# EAGLE design me433 (EAGLE 8.7.1)
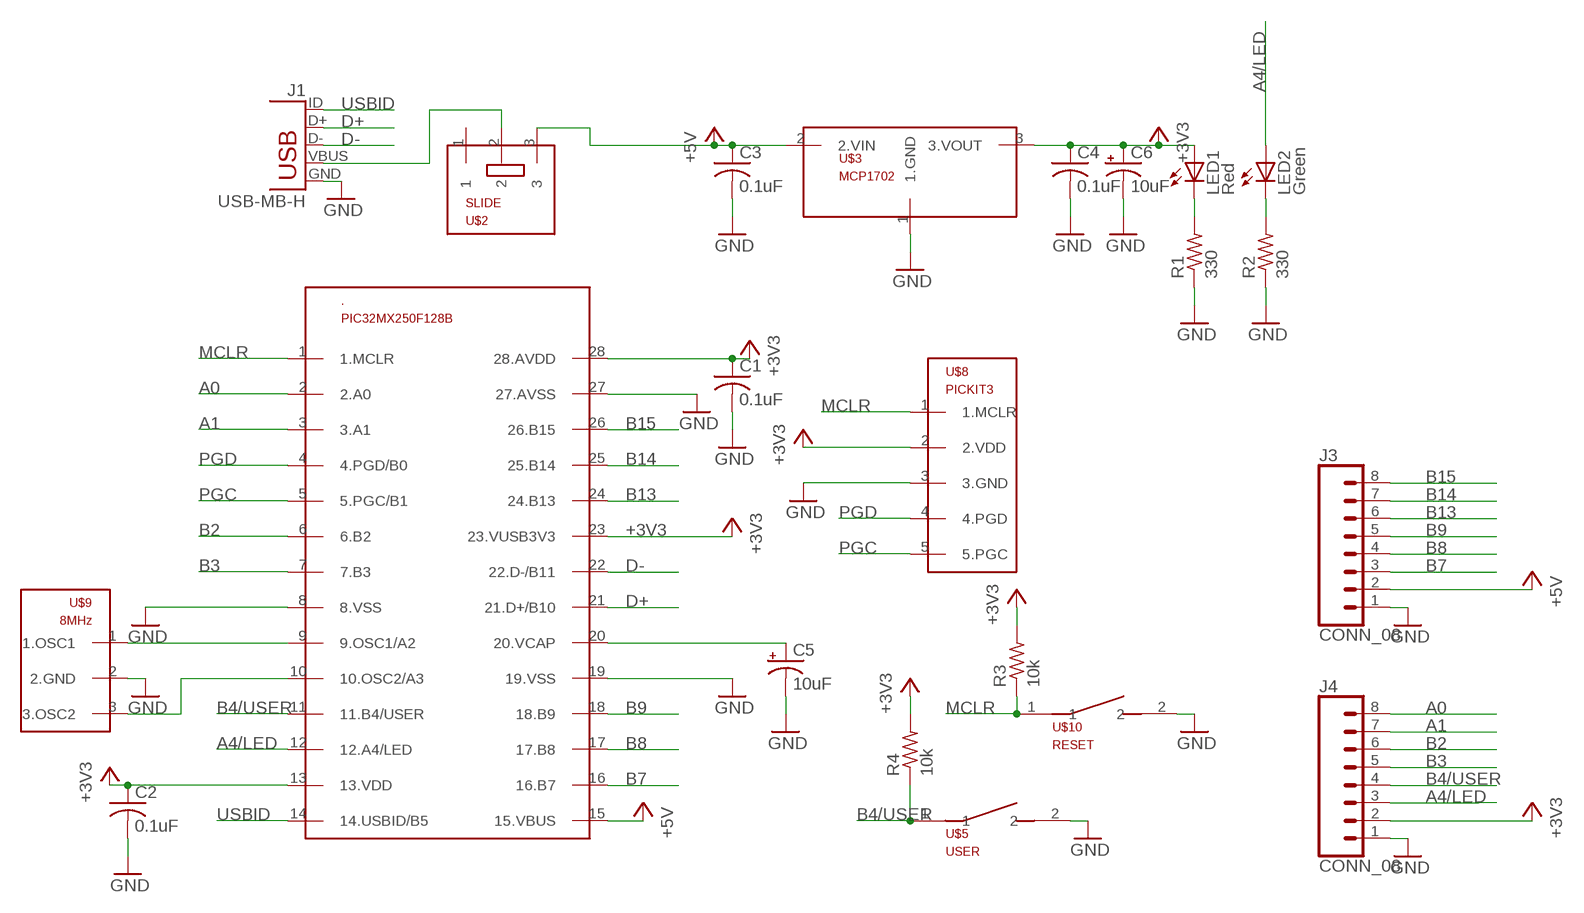
[diagram p0: schematic, sheet 1]

## Parts
.  PIC32MX250F128B  [DIL28-3]
C1  0.1uF  C-US025-025X050  [C025-025X050]
C2  0.1uF  C-US025-025X050  [C025-025X050]
C3  0.1uF  C-US025-025X050  [C025-025X050]
C4  0.1uF  C-US025-025X050  [C025-025X050]
C5  10uF  CPOL-USB45181B  [B45181B]
C6  10uF  CPOL-USB45181B  [B45181B]
J1  USB-MB-H  [USB-MB-H]
J3  CONN_08  [1X08]
J4  CONN_08  [1X08]
LED1  Red  LED3MM  [LED3MM]
LED2  Green  LED3MM  [LED3MM]
R1  330  R-US_0207/10  [0207/10]
R2  330  R-US_0207/10  [0207/10]
R3  10k  R-US_0207/10  [0207/10]
R4  10k  R-US_0207/10  [0207/10]
U$2  SLIDE  [SLIDE]
U$3  MCP1702  [TO92]
U$5  USER  PB  [PB]
U$8  PICKIT3  [1X05]
U$9  8MHz  OSC  [OSC]
U$10  RESET  PB  [PB]

## Nets
+3V3: ..13(13.VDD) ..23(23.VUSB3V3) ..28(28.AVDD) C1.1 C2.1 C4.1 C6.+ J4.2 LED1.A R3.2 R4.2 U$3.3(3.VOUT) U$8.2(2.VDD)
+5V: ..15(15.VBUS) C3.1 J3.2 U$2.3 U$3.2(2.VIN)
A0: ..2(2.A0) J4.8
A1: ..3(3.A1) J4.7
A4/LED: ..12(12.A4/LED) J4.3 LED2.A
B2: ..6(6.B2) J4.6
B3: ..7(7.B3) J4.5
B4/USER: ..11(11.B4/USER) J4.4 R4.1 U$5.1
B7: ..16(16.B7) J3.3
B8: ..17(17.B8) J3.4
B9: ..18(18.B9) J3.5
B13: ..24(24.B13) J3.6
B14: ..25(25.B14) J3.7
B15: ..26(26.B15) J3.8
D+: ..21(21.D+/B10) J1.D+
D-: ..22(22.D-/B11) J1.D-
GND: ..8(8.VSS) ..19(19.VSS) ..27(27.AVSS) C1.2 C2.2 C3.2 C4.2 C5.- C6.- J1.GND J3.1 J4.1 R1.1 R2.1 U$3.1(1.GND) U$5.2 U$8.3(3.GND) U$9.2(2.GND) U$10.2
MCLR: ..1(1.MCLR) R3.1 U$8.1(1.MCLR) U$10.1
N$1: LED2.K(C) R2.2
N$2: ..9(9.OSC1/A2) U$9.1(1.OSC1)
N$3: ..10(10.OSC2/A3) U$9.3(3.OSC2)
N$4: LED1.K(C) R1.2
N$6: ..20(20.VCAP) C5.+
PGC: ..5(5.PGC/B1) U$8.5(5.PGC)
PGD: ..4(4.PGD/B0) U$8.4(4.PGD)
USBID: ..14(14.USBID/B5) J1.ID
VBUS: J1.VBUS U$2.2
Unconnected: U$2.1

## Library data of the parts
. = me433:PIC32MX250F128B
C1-C4 = resistor:C-US: CAPACITOR, American symbol
C5 C6 = resistor:CPOL-US: POLARIZED CAPACITOR, American symbol
J1 = me433:USB: USB Connectors USB-B-PTH is fully proven SKU : PRT-00139/CONN-08278 USB-miniB is fully proven SKU : PRT-00587 USB-A-PCB is untested. USB-A-H is throughly reviewed, but untested. Spark Fun Electronics SKU : PRT-00437 USB-B-SMT is throughly reviewed, but untested. Needs silkscreen touching up. USB-A-S has not been used/tested USB-MB-H has not been used/tested USB-MICROB has been used. CONN-09505
J3 J4 = me433:CONN_08
LED1 LED2 = led:LED: LED OSRAM: - CHIPLED LG R971, LG N971, LY N971, LG Q971, LY Q971, LO R971, LY R971 LH N974, LH R974 LS Q976, LO Q976, LY Q976 LO Q996 - Hyper CHIPLED LW Q18S LB Q993, LB Q99A, LB R99A - SideLED LS A670, LO A670, LY A670, LG A670, LP A670 LB A673, LV A673, LT A673, LW A673 LH A674 LY A675 LS A676, LA A676, LO A676, LY A676, LW A676 LS A679, LY A679, LG A679 - Hyper Micro SIDELED® LS Y876, LA Y876, LO Y876, LY Y876 LT Y87S - SmartLED LW L88C, LW L88S LB L89C, LB L89S, LG L890 LS L89K, LO L89K, LY L89K LS L896, LA L896, LO L896, LY L896 - TOPLED LS T670, LO T670, LY T670, LG T670, LP T670 LSG T670, LSP T670, LSY T670, LOP T670, LYG T670 LG T671, LOG T671, LSG T671 LB T673, LV T673, LT T673, LW T673 LH T674 LS T676, LA T676, LO T676, LY T676, LB T676, LH T676, LSB T676, LW T676 LB T67C, LV T67C, LT T67C, LS T67K, LO T67K, LY T67K, LW E67C LS E67B, LA E67B, LO E67B, LY E67B, LB E67C, LV E67C, LT E67C LW T67C LS T679, LY T679, LG T679 LS T770, LO T770, LY T770, LG T770, LP T770 LB T773, LV T773, LT T773, LW T773 LH T774 LS E675, LA E675, LY E675, LS T675 LS T776, LA T776, LO T776, LY T776, LB T776 LHGB T686 LT T68C, LB T68C - Hyper Mini TOPLED® LB M676 - Mini TOPLED Santana® LG M470 LS M47K, LO M47K, LY M47K Source: http://www.osram.convergy.de LUXEON: - LUMILED® LXK2-PW12-R00, LXK2-PW12-S00, LXK2-PW14-U00, LXK2-PW14-V00 LXK2-PM12-R00, LXK2-PM12-S00, LXK2-PM14-U00 LXK2-PE12-Q00, LXK2-PE12-R00, LXK2-PE12-S00, LXK2-PE14-T00, LXK2-PE14-U00 LXK2-PB12-K00, LXK2-PB12-L00, LXK2-PB12-M00, LXK2-PB14-N00, LXK2-PB14-P00, LXK2-PB14-Q00 LXK2-PR12-L00, LXK2-PR12-M00, LXK2-PR14-Q00, LXK2-PR14-R00 LXK2-PD12-Q00, LXK2-PD12-R00, LXK2-PD12-S00 LXK2-PH12-R00, LXK2-PH12-S00 LXK2-PL12-P00, LXK2-PL12-Q00, LXK2-PL12-R00 Source: www.luxeon.com KINGBRIGHT: KA-3528ASYC Source: www.kingbright.com
R1-R4 = resistor:R-US_: RESISTOR, American symbol
U$2 = me433:SLIDE
U$3 = me433:MCP1702
U$5 U$10 = me433:PB
U$8 = me433:PICKIT3
U$9 = me433:OSC

## Board
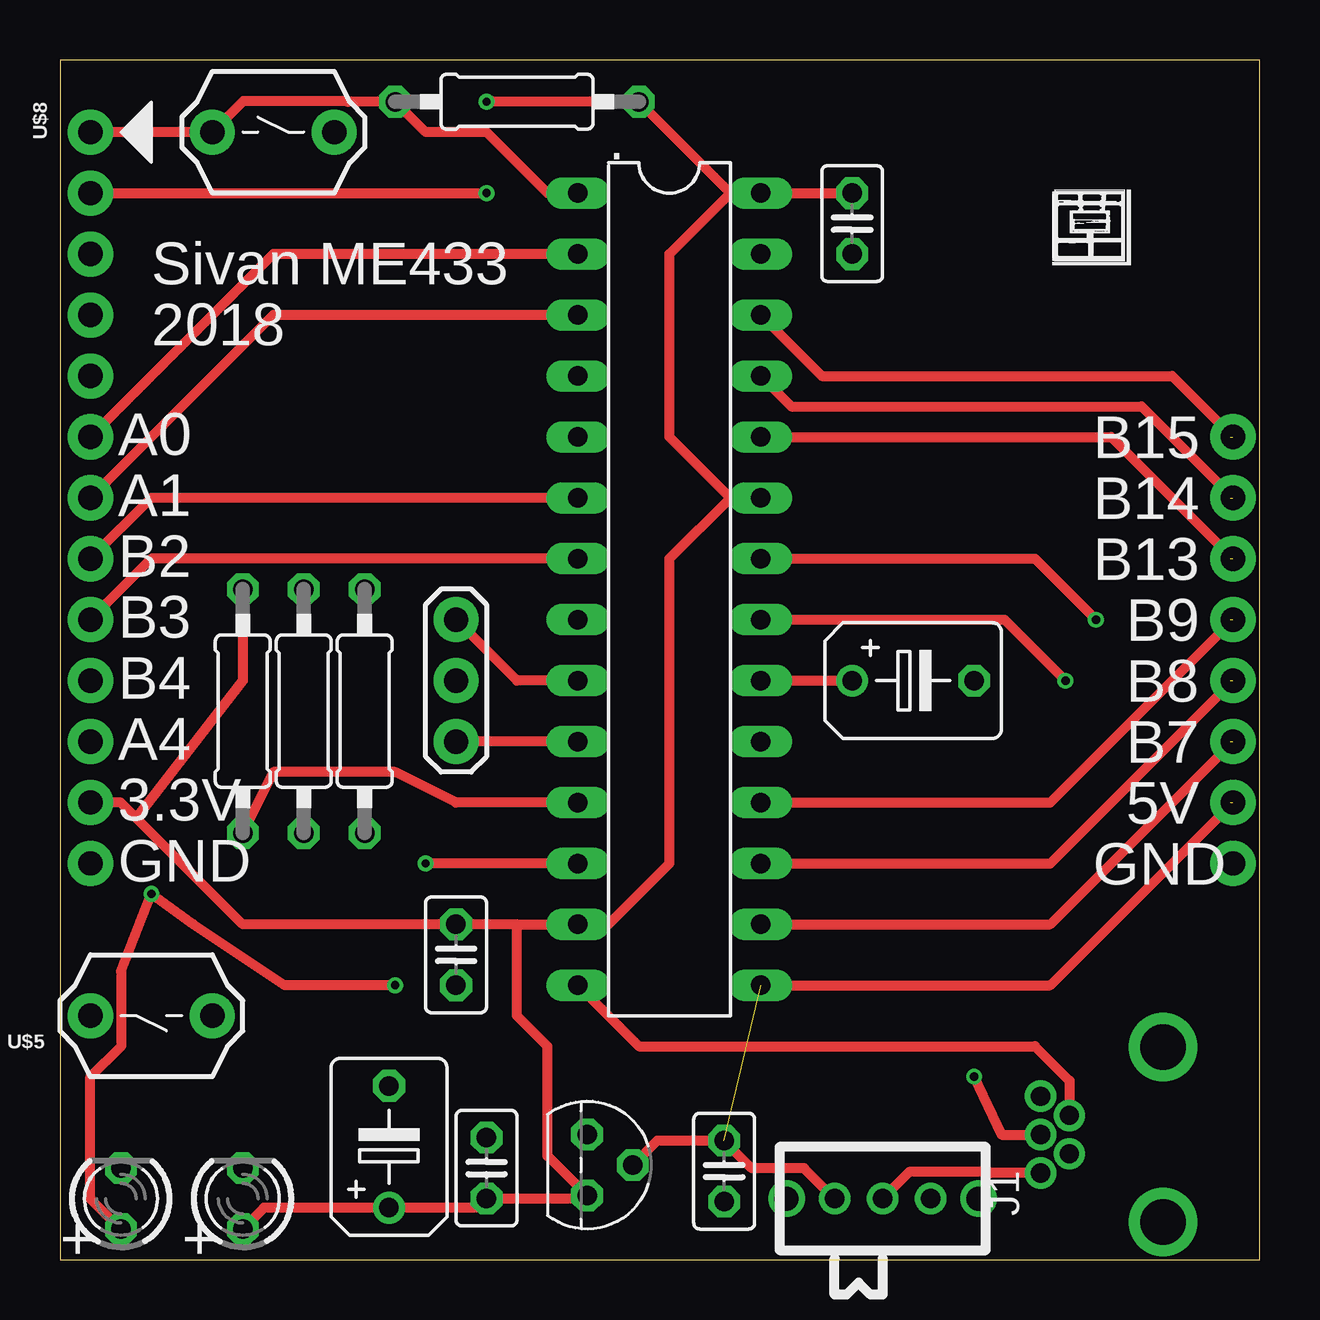
[diagram p1: board, top side]
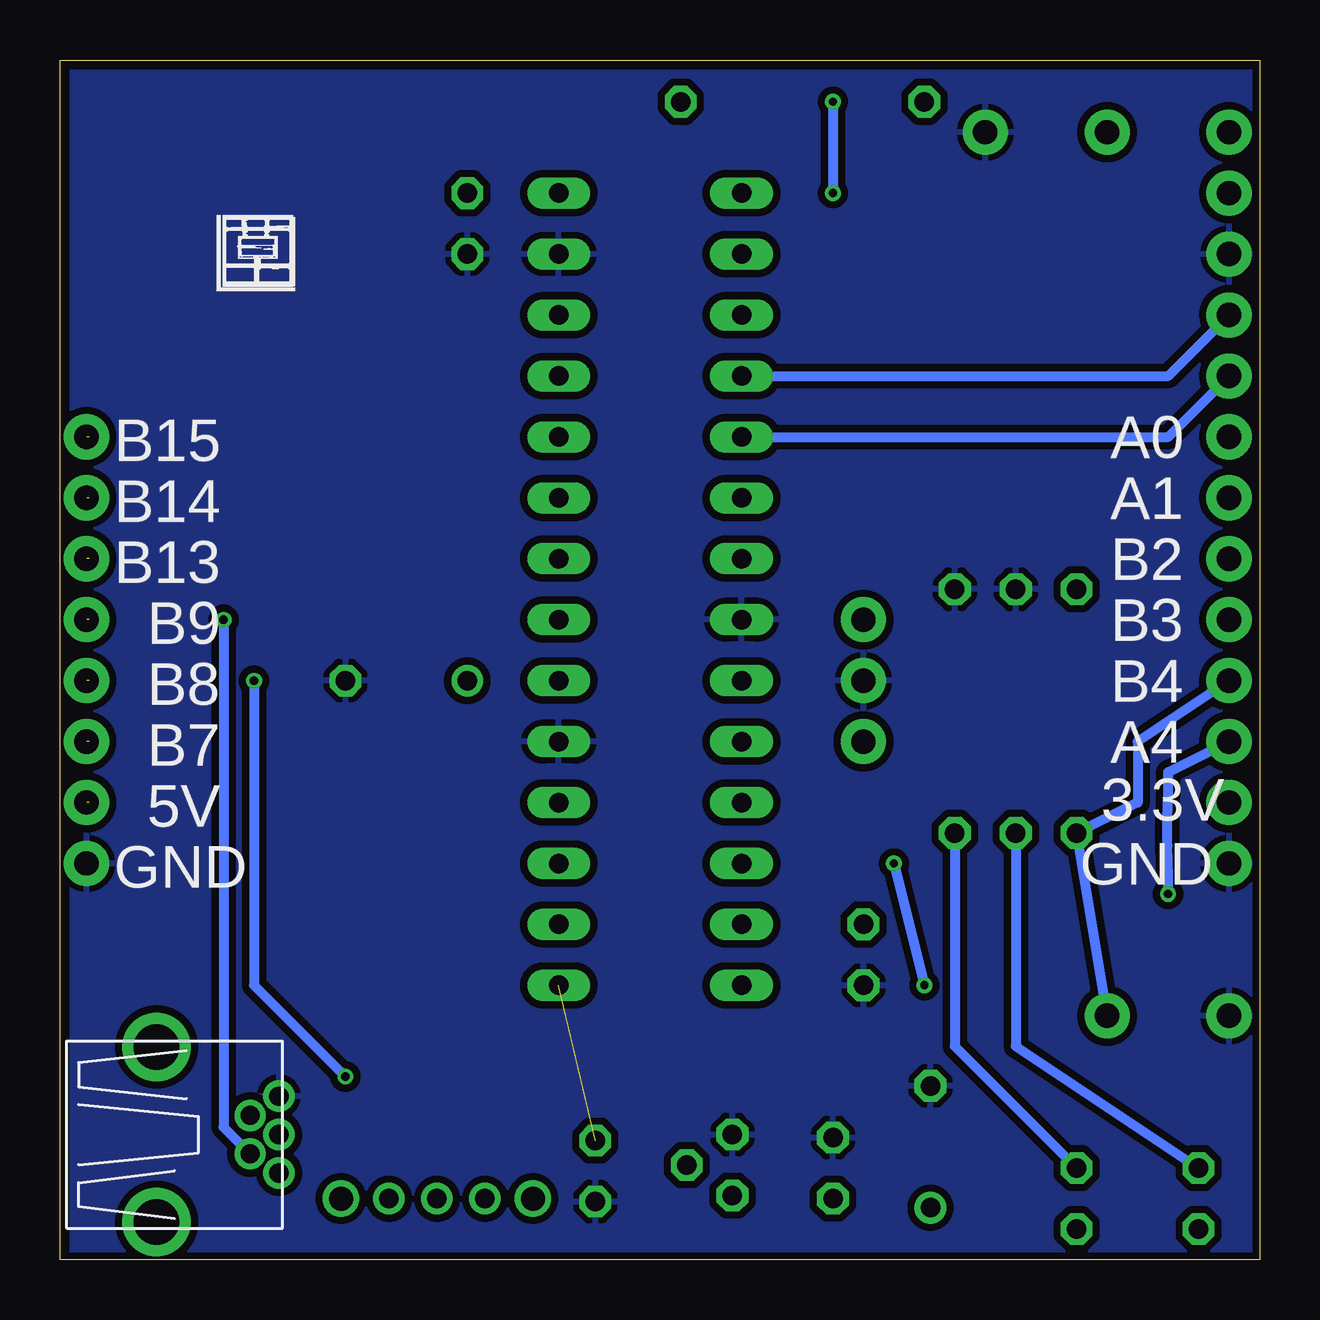
[diagram p2: board, bottom side, seen from below]

Size 50 x 50 mm. Coordinates in mm from the lower left corner, seen from the top.
Outline: 0,0 50,0 50,50 0,50 0,0
Copper layers (1*16): Top 0.035mm / dielectric 1.5mm / Bottom 0.035mm
Design rules "SeeedStudio_2layer_DRU_no_angle_20140221": minimum track width 6mil, minimum drill 12mil, track to track 6mil, track to pad 6mil, pad to pad 6mil, via to via 6mil, smd to smd 0mil, copper to edge 10mil, drill to drill 10mil, minimum pad ring 10mil, minimum via ring 6mil, stop-mask expansion 2mil, vias tented up to drill 100mil, thermal gap 10mil

### Footprints (pad centres in the part's own frame; a part is rotated, then mirrored left to right if it is on the bottom)
DIL28-3 = drill 0.813 long: 1 -16.51,-3.81; 2 -13.97,-3.81; 3 -11.43,-3.81; 4 -8.89,-3.81; 5 -6.35,-3.81; 6 -3.81,-3.81; 7 -1.27,-3.81; 8 1.27,-3.81; 9 3.81,-3.81; 10 6.35,-3.81; 11 8.89,-3.81; 12 11.43,-3.81; 13 13.97,-3.81; 14 16.51,-3.81; 15 16.51,3.81; 16 13.97,3.81; 17 11.43,3.81; 18 8.89,3.81; 19 6.35,3.81; 20 3.81,3.81; 21 1.27,3.81; 22 -1.27,3.81; 23 -3.81,3.81; 24 -6.35,3.81; 25 -8.89,3.81; 26 -11.43,3.81; 27 -13.97,3.81; 28 -16.51,3.81
C025-025X050 = drill 0.813 octagon: 1 -1.27,0; 2 1.27,0
B45181B = drill 0.813: + -2.54,0 | drill 0.813 octagon: - 2.54,0
USB-MB-H = drill 0.8: D+ 5.1,0; D- 3.9,0.8; GND 5.1,-1.6; ID 3.9,-0.8; VBUS 5.1,1.6 | drill 1.9: P$6 0,-3.65; P$7 0,3.65
1X08 = drill 1.016 pad 1.88: 1 0,0; 2 2.54,0; 3 5.08,0; 4 7.62,0; 5 10.16,0; 6 12.7,0; 7 15.24,0; 8 17.78,0
LED3MM = drill 0.813 octagon: A -1.27,0; K 1.27,0
0207/10 = drill 0.813 octagon: 1 -5.08,0; 2 5.08,0
SLIDE = drill 0.8: 1 -2,0; 2 0,0; 3 2,0 | drill 1: P$1 -4,0; P$2 4,0
TO92 = drill 0.813 octagon: 1 -1.27,0; 2 0,1.905; 3 1.27,0
PB = drill 1.016 pad 1.88: 1 -2.54,0; 2 2.54,0
1X05 = drill 1.016 pad 1.88: 1 0,0; 2 2.54,0; 3 5.08,0; 4 7.62,0; 5 10.16,0
OSC = drill 1.016 pad 1.88: 1 -2.54,0; 2 0,0; 3 2.54,0

### Placement (x,y rotation side)
.  25.4,27.94 270 top
C1  33.02,43.18 270 top
C2  16.51,12.7 270 top
C3  27.69,3.68 270 top
C4  17.78,3.81 90 top
C5  35.56,24.13 0 top
C6  13.72,4.7 90 top
J1  45.97,5.21 180 top
J3  48.9,16.51 90 top
J4  1.27,16.51 90 top
LED1  7.62,2.54 90 top
LED2  2.54,2.54 90 top
R1  12.7,22.86 270 top
R2  10.16,22.86 270 top
R3  19.05,48.26 0 top
R4  7.62,22.86 90 top
U$2  34.29,2.54 180 top
U$3  21.97,3.94 270 top
U$5  3.81,10.16 180 top
U$8  1.27,46.99 270 top
U$9  16.51,24.13 270 top
U$10  8.89,46.99 0 top

### Tracks (layer width: path | path; a pad name or v marks a point on that pad's centre or on a via)
+3V3  (via drill 0.35)
  Top 0.406: LED1.A 8.51,2.16 C6.+ 17.4,2.16 C4.1 21.84,2.54 U$3.3 20.32,4.32 20.32,8.89 19.05,10.16 19.05,13.97 | 19.05,13.97 ..13 22.86,13.97 25.4,16.51 25.4,29.21 27.94,31.75 | 19.05,13.97 C2.1 7.62,13.97 3.17,18.41 | ..23 27.94,31.75 | 27.94,31.75 25.4,34.29 25.4,41.91 27.94,44.45 | C1.1 ..28 27.94,44.45 | 27.94,44.45 R3.2 v17.78,48.26 | U$8.2 v17.78,44.45 | 3.17,18.41 2.54,19.05 J4.2 | 3.17,18.41 7.62,24.13 R4.2
  Bottom 0.406: v17.78,48.26 v17.78,44.45
+5V  (2 unrouted)
  Top 0.406: U$2.3 31.02,3.81 28.83,3.81 C3.1 24.89,4.95 U$3.2 | ..15 41.27,11.43 48.78,18.94 48.78,19.05
A0
  Top 0.406: ..2 8.89,41.91 J4.8
A1
  Top 0.406: ..3 8.89,39.37 J4.7
A4/LED  (via drill 0.35)
  Top 0.406: LED2.A 1.27,2.54 1.27,7.62 2.56,8.91 2.56,11.97 2.54,11.99 v3.81,15.24 5.56,13.97 9.37,11.43 v13.97,11.43 | ..12 v15.24,16.51
  Bottom 0.406: v3.81,15.24 3.81,15.95 3.83,17.24 3.83,18.32 3.81,19.61 3.81,20.32 J4.3 1.39,21.59 | v15.24,16.51 v13.97,11.43
B2
  Top 0.406: ..6 3.81,31.75 J4.6
B3
  Top 0.406: ..7 3.81,29.21 J4.5
B4/USER
  Top 0.406: ..11 16.51,19.05 13.97,20.32 8.89,20.32 R4.1
  Bottom 0.406: J4.4 5.08,21.59 5.08,19.05 R4.1 U$5.1
B7  (1 unrouted)
  Top 0.406: ..16 41.27,13.97 48.78,21.48 48.78,21.59
B8  (1 unrouted)
  Top 0.406: ..17 41.27,16.51 48.78,24.02 48.78,24.13
B9  (1 unrouted)
  Top 0.406: ..18 41.27,19.05 48.78,26.56 48.78,26.67
B13  (1 unrouted)
  Top 0.406: 48.26,29.21 48.78,29.21 48.78,29.32 43.81,34.29 ..24
B14  (1 unrouted)
  Top 0.406: ..25 30.48,35.56 45.09,35.56 48.78,31.86 48.78,31.75
B15  (1 unrouted)
  Top 0.406: ..26 31.75,36.83 46.35,36.83 48.78,34.4 48.78,34.29
D+  (via drill 0.35)
  Top 0.406: ..21 39.37,26.67 v41.91,24.13 | v38.1,7.62 39.24,5.21 J1.D+
  Bottom 0.406: v41.91,24.13 41.91,11.43 v38.1,7.62
D-  (via drill 0.35)
  Top 0.406: ..22 40.64,29.21 v43.18,26.67
  Bottom 0.406: v43.18,26.67 43.18,5.51 J1.D-
GND
  pour Bottom (isolate 0.305): 0,49.53 49.53,49.53 49.53,0 0,0
MCLR
  Top 0.406: U$8.1 U$10.1 7.64,48.28 11.97,48.28 11.99,48.26 R3.1 15.24,46.99 17.78,46.99 20.32,44.45 ..1
N$1
  Bottom 0.406: R2.2 10.16,8.89 LED2.K
N$2
  Top 0.406: ..9 19.05,24.13 U$9.1
N$3
  Top 0.406: ..10 U$9.3
N$4
  Bottom 0.406: LED1.K 12.7,8.89 R1.2
N$6
  Top 0.406: ..20 C5.+
PGC
  Bottom 0.406: ..5 3.81,34.29 U$8.5
PGD
  Bottom 0.406: ..4 3.81,36.83 U$8.4
USBID
  Top 0.406: ..14 24.13,8.89 40.64,8.89 42.07,7.46 J1.ID
VBUS
  Top 0.406: J1.VBUS 38.79,3.61 38.75,3.65 35.4,3.65 U$2.2

### Text on the board
tPlace: Sivan ME433 | 2018 | A0 | B15 | A1 | B14 | B2 | B13 | B3 | B9 | B4 | B8 | A4 | B7 | 3.3V | 5V | GND | GND | + | +
bPlace: A0 | B15 | A1 | B14 | B2 | B13 | B3 | B9 | B4 | B8 | A4 | B7 | 3.3V | 5V | GND | GND